# EAGLE design tb_projekt_rfm12b_board_v1_0 (EAGLE 6.5.0)
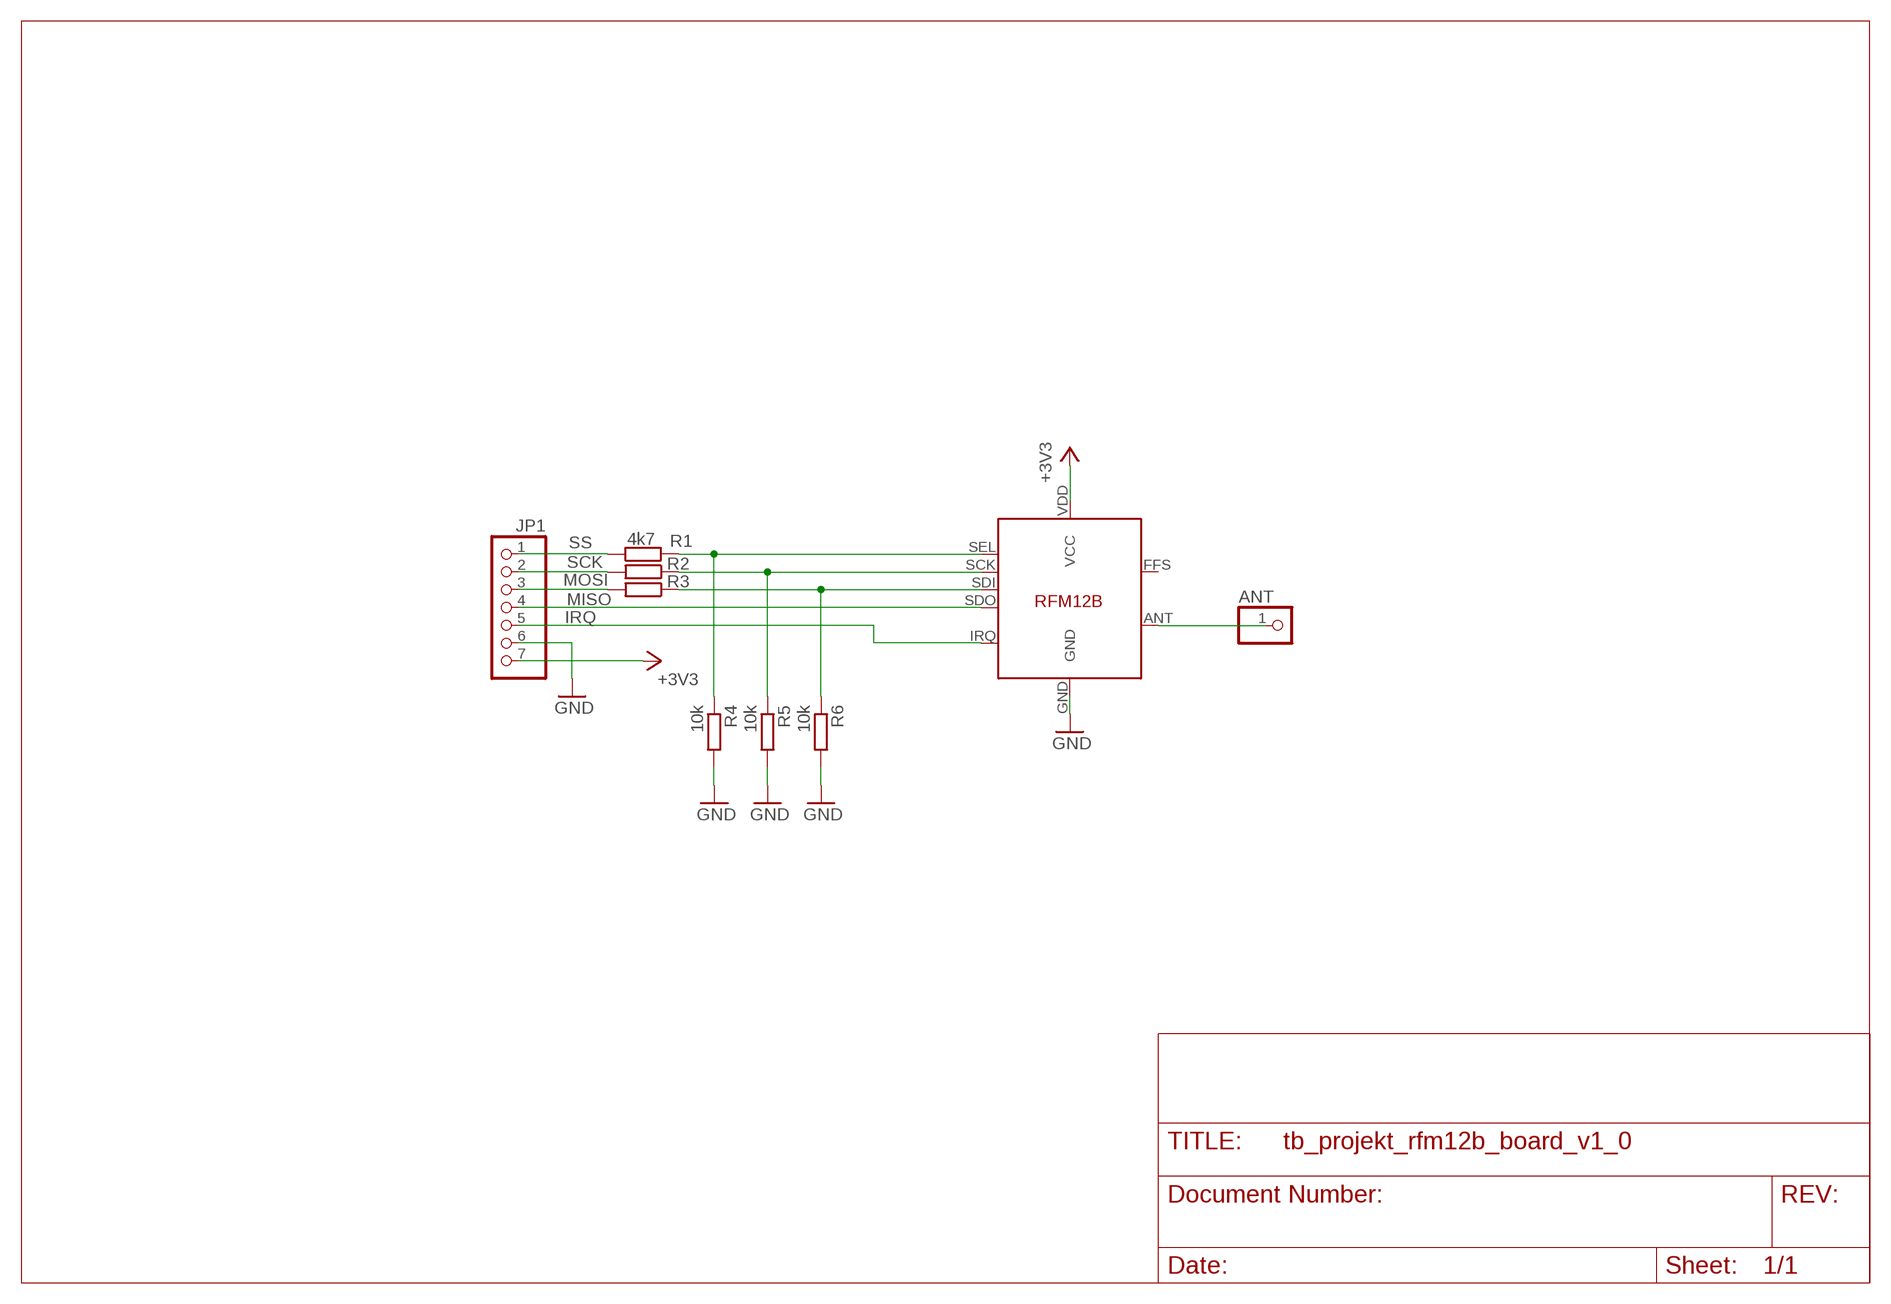
[diagram p0: schematic, sheet 1]

## Parts
ANT  PINHD-1X1  [1X01]
IC1  RFM12B  [RFM12B]
JP1  PINHD-1X7  [1X07]
R1  4k7  R-EU_0207/7  [0207/7]
R2  R-EU_0207/7  [0207/7]
R3  R-EU_0207/7  [0207/7]
R4  10k  R-EU_0207/7  [0207/7]
R5  10k  R-EU_0207/7  [0207/7]
R6  10k  R-EU_0207/7  [0207/7]

## Nets
+3V3: IC1.VDD(VCC) JP1.7
GND: IC1.GND JP1.6 R4.2 R5.2 R6.2
IRQ: IC1.IRQ JP1.5
MISO: IC1.SDO JP1.4
MOSI: JP1.3 R3.2
N$1: ANT.1 IC1.ANT
N$2: IC1.SDI R3.1 R6.1
N$3: IC1.SCK R2.1 R5.1
N$4: IC1.SEL R1.2 R4.1
SCK: JP1.2 R2.2
SS: JP1.1 R1.1
Unconnected: IC1.FFS

## Library data of the parts
ANT = pinhead:PINHD-1X1: PIN HEADER
IC1 = JeeParts:RFM12B
JP1 = pinhead:PINHD-1X7: PIN HEADER
R1-R6 = resistor:R-EU_: RESISTOR, European symbol

## Board
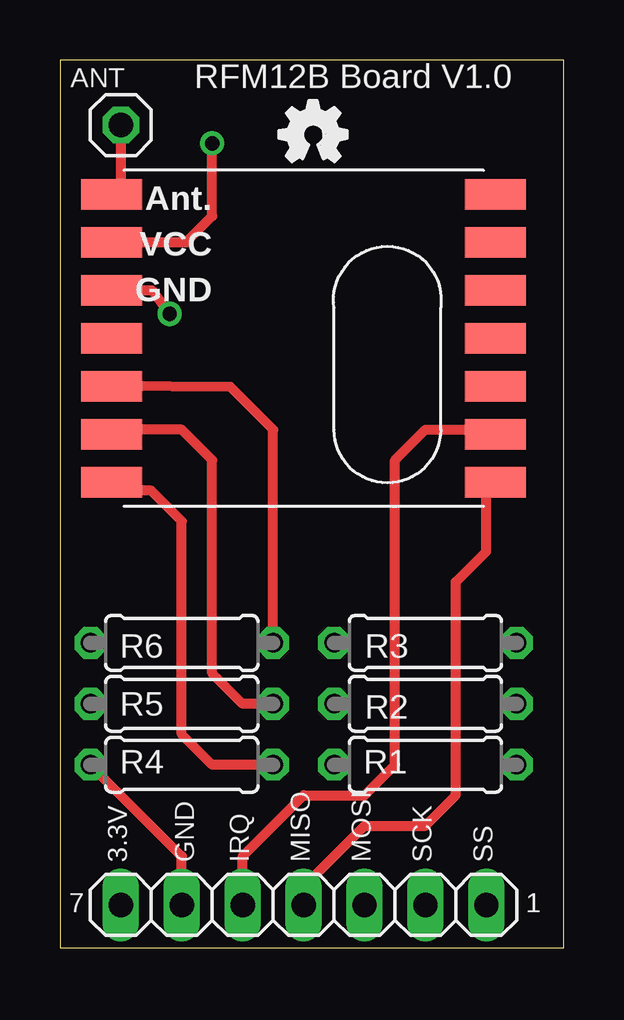
[diagram p1: board, top side]
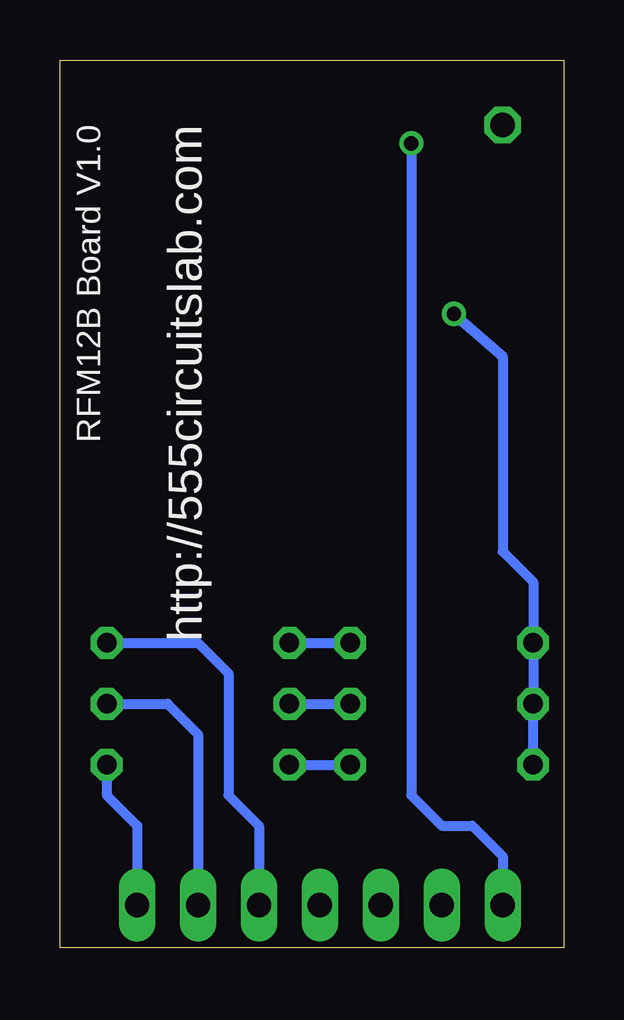
[diagram p2: board, bottom side, seen from below]

Size 21 x 37 mm. Coordinates in mm from the lower left corner, seen from the top.
Outline: 0,0 21,0 21,37 0,37 0,0
Copper layers (1*16): Top 0.035mm / dielectric 1.5mm / Bottom 0.035mm
Design rules "default": minimum track width 10mil, minimum drill 24mil, track to track 8mil, track to pad 8mil, pad to pad 8mil, via to via 8mil, smd to smd 8mil, copper to edge 40mil, drill to drill 8mil, minimum pad ring 10mil, minimum via ring 8mil, stop-mask expansion 4mil, vias tented up to drill 0mil, thermal gap 10mil

### Footprints (pad centres in the part's own frame; a part is rotated, then mirrored left to right if it is on the bottom)
1X01 = drill 1.016 octagon: 1 0,0
RFM12B = smd 2.54 x 1.27: ANT 8,-6; FFS -8,2; GND 8,-2; IRQ -8,4; P$8 -8,0; P$9 -8,-2; P$10 -8,-4; P$12 -8,-6; P$16 8,0; SCK 8,4; SDI 8,2; SDO -8,6; SEL 8,6; VDD 8,-4
1X07 = drill 1.016 long: 1 -7.62,0; 2 -5.08,0; 3 -2.54,0; 4 0,0; 5 2.54,0; 6 5.08,0; 7 7.62,0
0207/7 = drill 0.813 octagon: 1 -3.81,0; 2 3.81,0

### Placement (x,y rotation side)
ANT  2.54,34.29 0 top
IC1  10.16,25.4 180 top
JP1  10.16,1.78 180 top
R1  15.24,7.62 180 top
R2  15.24,10.16 0 top
R3  15.24,12.7 0 top
R4  5.08,7.62 180 top
R5  5.08,10.16 180 top
R6  5.08,12.7 180 top
U$1  [OSHW_FILLX100_NOTEXT]  9.14,32.77 0 top

### Tracks (layer width: path | path; a pad name or v marks a point on that pad's centre or on a via)
+3V3  (via drill 0.6)
  Top 0.406: IC1.VDD 5.27,29.4 6.35,30.48 v6.35,33.53
  Bottom 0.406: v6.35,33.53 6.35,6.35 5.08,5.08 3.81,5.08 2.54,3.81 JP1.7
GND  (via drill 0.6)
  Top 0.406: JP1.6 5.08,3.81 R4.2 | IC1.GND 3.84,27.4 v4.57,26.42
  Bottom 0.406: R4.2 R5.2 R6.2 1.27,15.24 2.54,16.51 2.54,24.64 v4.57,26.42
IRQ
  Top 0.406: JP1.5 7.62,3.81 10.16,6.35 12.7,6.35 13.97,7.62 13.97,20.32 15.24,21.59 17.97,21.59 IC1.IRQ
MISO
  Top 0.406: IC1.SDO 17.78,19.02 17.78,16.51 16.51,15.24 16.51,6.35 15.24,5.08 12.7,5.08 10.16,2.54 JP1.4
MOSI
  Bottom 0.406: R3.2 15.24,12.7 13.97,11.43 13.97,6.35 12.7,5.08 JP1.3
N$1
  Top 0.406: ANT.1 2.54,31.78 IC1.ANT
N$2
  Top 0.406: R6.1 8.89,21.59 7.11,23.37 IC1.SDI
  Bottom 0.406: R3.1 R6.1
N$3
  Top 0.406: R5.1 7.62,10.16 6.35,11.43 6.35,20.32 5.08,21.59 2.35,21.59 IC1.SCK
  Bottom 0.406: R2.1 R5.1
N$4
  Top 0.406: R4.1 6.35,7.62 5.08,8.89 5.08,17.78 3.81,19.05 2.51,19.05 IC1.SEL
  Bottom 0.406: R1.2 R4.1
SCK
  Bottom 0.406: R2.2 16.51,10.16 15.24,8.89 JP1.2
SS
  Bottom 0.406: R1.1 19.05,6.35 17.78,5.08 JP1.1

### Text on the board
tNames: RFM12B Board V1.0 | 3.3V | GND | IRQ | MISO | MOSI | SCK | SS | 7 | 1
bNames: http://555circuitslab.com | RFM12B Board V1.0